# Altium schematic sheet USB.SchDoc
size A4; SheetNumber: 3; SheetTotal: 7
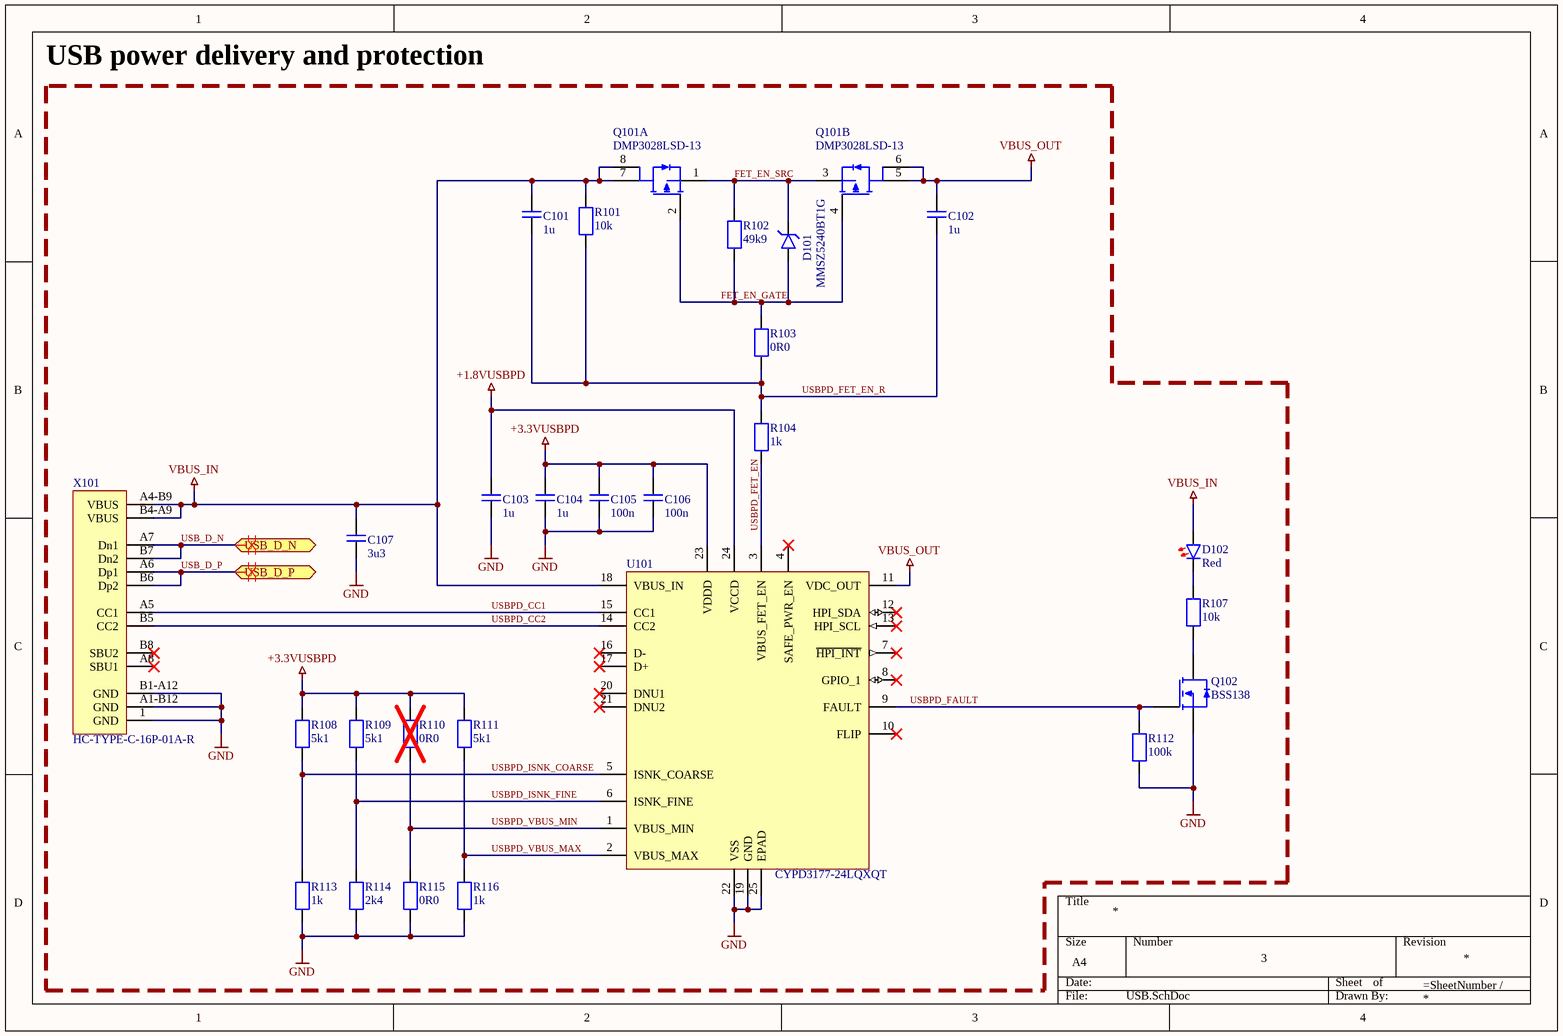
[diagram p0: USB.SchDoc]

## Parts
C101  1u  [CAPC0603]
C102  1u  [CAPC0603]
C103  1u  [CAPC0603]
C104  1u  [CAPC0603]
C105  100n  [CAPC0603]
C106  100n  [CAPC0603]
C107  3u3  [CAPC0603]
D101  MMSZ5240BT1G  [SODFL368160X117]
D102  Red  [LED0603]
Q101  DMP3028LSD-13  [SOIC127P620X175-8]  (parts A,B of 2)
Q102  BSS138  [SOT190P240X290-3]
R101  10k  [RESC0603]
R102  49k9  [RESC0603]
R103  0R0  [RESC0603]
R104  1k  [RESC0603]
R107  10k  [RESC0603]
R108  5k1  [RESC0603]
R109  5k1  [RESC0603]
R110  0R0  [RESC0603]
R111  5k1  [RESC0603]
R112  100k  [RESC0603]
R113  1k  [RESC0603]
R114  2k4  [RESC0603]
R115  0R0  [RESC0603]
R116  1k  [RESC0603]
U101  CYPD3177-24LQXQT  [QFN50P410X410X100-24EP]
X101  HC-TYPE-C-16P-01A-R  [GCT_USB4105-GF-A]

## Blocks framed on the sheet
USB power delivery and protection: C101-C107 D101 D102 Q101 Q102 R101-R104 R107-R116 U101 X101

## Ports
USB_D_N (bidir, see WIRELESS[2B]), USB_D_P (bidir, see WIRELESS[2B])

## Nets
+1.8VUSBPD: C103.2 U101.24(VCCD)
+3.3VUSBPD: C104.2 C105.2 C106.2 R108.2 R109.2 R110.2 R111.2 U101.23(VDDD)
GND: C103.1 C104.1 C105.1 C106.1 C107.1 Q102.2(S) R112.1 R113.1 R114.1 R115.1 R116.1 U101.19(GND) U101.22(VSS) U101.25(EPAD) X101.1(GND) X101.A1-B12(GND) X101.B1-A12(GND)
VBUS_IN: C101.2 C107.2 D102.2 Q101.7(D1) Q101.8(D1) R101.2 U101.18(VBUS_IN) X101.A4-B9(VBUS) X101.B4-A9(VBUS)
VBUS_OUT: C102.2 Q101.5(D2) Q101.6(D2) U101.11(VDC_OUT)
FET_EN_GATE: D101.2 Q101.2(G1) Q101.4(G2) R102.1 R103.2
FET_EN_SRC: D101.1 Q101.1(S1) Q101.3(S2) R102.2
USB_D_N: X101.A7(Dn1) X101.B7(Dn2) ; port USB_D_N
USB_D_P: X101.A6(Dp1) X101.B6(Dp2) ; port USB_D_P
USBPD_CC1: U101.15(CC1) X101.A5(CC1)
USBPD_CC2: U101.14(CC2) X101.B5(CC2)
USBPD_FAULT: Q102.1(G) R112.2 U101.9(FAULT)
USBPD_FET_EN: R104.1 U101.3(VBUS_FET_EN)
USBPD_FET_EN_R: C101.1 C102.1 R101.1 R103.1 R104.2
USBPD_ISNK_COARSE: R108.1 R113.2 U101.5(ISNK_COARSE)
USBPD_ISNK_FINE: R109.1 R114.2 U101.6(ISNK_FINE)
USBPD_VBUS_MAX: R111.1 R116.2 U101.2(VBUS_MAX)
USBPD_VBUS_MIN: R110.1 R115.2 U101.1(VBUS_MIN)
NetD102_1: D102.1 R107.2
NetQ102_3: Q102.3(D) R107.1

Not connected (* = marked no-connect by the designer): U101 4(SAFE_PWR_EN)* 7(~{HPI_INT})* 8(GPIO_1)* 10(FLIP)* 12(HPI_SDA)* 13(HPI_SCL)* 16(D-)* 17(D+)* 20(DNU1)* 21(DNU2)*; X101 A8(SBU1)* B8(SBU2)*

## Layout directives
differential pair: USB_D_N, USB_D_P

## Library data of the parts
C101-C104 = CAPC0603-1u-10: Ceramic capacitor, 1uF,  50V, X5R; MFR: Murata Electronics; MFRN: GRT188R61H105KE13D; SPN: 81-GRT188R61H105KE3D; Checked: Yes; Footprint: 0603; Supplier: Mouser; Link: https://hr.mouser.com/ProductDetail/Murata-Electronics/GRT188R61H105KE13D?qs=drgMNd%252BkGPNIxxtJByMGCg%3D%3D
C105 C106 = CAPC0603-100n-10: Ceramic capacitor, 100nF,  50V, X7R; MFR: KEMET; MFRN: C0603C104K5RACAUTO; SPN: 80-C0603C104K5RAUTO; Checked: Yes; Footprint: 0603; Supplier: Mouser; Link: https://hr.mouser.com/ProductDetail/KEMET/C0603C104K5RACAUTO?qs=8xX%252BF9%252BWV6EZsgKw9G0PqQ%3D%3D
C107 = CAPC0603-3u3-10: Ceramic capacitor, 3.3uF,  25V, X5R; MFR: TDK; MFRN: C1608X5R1E335K080AC; SPN: 810-C1608X5R1E335KAC; Checked: Yes; Footprint: 0603; Supplier: Mouser; Link: https://hr.mouser.com/ProductDetail/TDK/C1608X5R1E335K080AC?qs=6JAMGB%252BEdkxFHV26vmpHrw%3D%3D
D101 = MMSZ5240BT1G: Zener Dioode, 10V, 500mW; MFR: onsemi; SPN: 863-MMSZ5240BT1G; Checked: Yes; Footprint: SOD-123-2; Supplier: Mouser; MFRN: MMSZ5240BT1G; Link: https://hr.mouser.com/ProductDetail/onsemi/MMSZ5240BT1G?qs=P4IOph%252Bbot9clcYADZoEXg%3D%3D
D102 = 150060RS75000: LED Red, 2.3V, 20mA; MFR: Würth Elektronik; SPN: 710-150060RS75000; Checked: Yes; Footprint: 0603; Supplier: Mouser; MFRN: 150060RS75000; Link: https://hr.mouser.com/ProductDetail/Wurth-Elektronik/150060RS75000?qs=LlUlMxKIyB3QnmZ3fw%2FVCA%3D%3D
Q101 = DMP3028LSD-13: MOSFET, 2P-CH, 30V, 6A; MFR: Diodes Incorporated; SPN: 621-DMP3028LSD-13; Checked: Yes; Footprint: SOIC-8; Supplier: Mouser; MFRN: DMP3028LSD-13; Link: https://hr.mouser.com/ProductDetail/Diodes-Incorporated/DMP3028LSD-13?qs=HXx4m3XcTe1Oo5qgV%252BCezQ%3D%3D
Q102 = BSS138: MOSFET, N-CH, 50V, 220mA; MFR: onsemi; SPN: 512-BSS138; Checked: Yes; Footprint: SOT23-3; Supplier: Mouser; MFRN: BSS138; Link: https://hr.mouser.com/ProductDetail/onsemi-Fairchild/BSS138?qs=HK%252BeIG1iaahCeqBvjB4arg%3D%3D
R101 R107 = RES0603-10k-1: Thick film resistor, 10kOhm, 100mW; MFR: YAGEO; MFRN: RC0603FR-1010KL; SPN: 603-RC0603FR-1010KL; Checked: Yes; Footprint: 0603; Supplier: Mouser; Link: https://hr.mouser.com/ProductDetail/YAGEO/RC0603FR-1010KL?qs=sGAEpiMZZMtlubZbdhIBIHvQf5egq9lvqRHakiGwa0o%3D
R102 = RES0603-49k9-1: Thick film resistor, 49.9kOhms, 100mW; MFR: YAGEO; MFRN: RC0603FR-0749K9L; SPN: 603-RC0603FR-0749K9L; Checked: Yes; Footprint: 0603; Supplier: Mouser; Link: https://hr.mouser.com/ProductDetail/YAGEO/RC0603FR-0749K9L?qs=sGAEpiMZZMtlubZbdhIBIItYu4jZFrq85kB0%2FAGdri8%3D
R103 R110 R115 = RES0603-0R0-1: Thick film resistor, 0Ohms, 100mW; MFR: YAGEO; MFRN: RC0603FR-070RL; SPN: 603-RC0603FR-070RL; Checked: Yes; Footprint: 0603; Supplier: Mouser; Link: https://hr.mouser.com/ProductDetail/YAGEO/RC0603FR-070RL?qs=0yPvnVz5%2FmpDQv43TwvCfw%3D%3D
R104 R113 R116 = RES0603-1k-1: Thick film resistor, 1k, 100mW; MFR: YAGEO; MFRN: RC0603FR-071KL; SPN: 603-RC0603FR-071KL; Checked: Yes; Footprint: 0603; Supplier: Mouser; Link: https://hr.mouser.com/ProductDetail/YAGEO/RC0603FR-071KL?qs=VU8sRB4EgwApHsk4rF%2F3zg%3D%3D
R108 R109 R111 = RES0603-5k1-1: Thick film resistor, 5.1kOhms, 100mW; MFR: YAGEO; MFRN: RC0603FR-075K1L; SPN: 603-RC0603FR-075K1L; Checked: Yes; Footprint: 0603; Supplier: Mouser; Link: https://hr.mouser.com/ProductDetail/YAGEO/RC0603FR-075K1L?qs=gt6vzsuosg2jUUwxnI2PJQ%3D%3D
R112 = RES0603-100k-1: Thick film resistor, 100kOhms, 100mW; MFR: YAGEO; MFRN: CRCW0603100KFKEA; SPN: 71-CRCW0603-100K-E3; Checked: Yes; Footprint: 0603; Supplier: Mouser; Link: https://hr.mouser.com/ProductDetail/Vishay-Dale/CRCW0603100KFKEA?qs=6dqgS%252BKntICWHMMdIzt5%2FQ%3D%3D
R114 = RES0603-2k4-1: Thick film resistor, 2.4kOhms, 100mW; MFR: YAGEO; MFRN: RC0603FR-072K4L; SPN: 603-RC0603FR-072K4L; Checked: Yes; Footprint: 0603; Supplier: Mouser; Link: https://hr.mouser.com/ProductDetail/YAGEO/RC0603FR-072K4L?qs=0yPvnVz5%2FmrC6p3yyBfpHw%3D%3D
U101 = CYPD3177-24LQXQT: Generic Description; MFR: Infineon Technologies; SPN: 727-CYPD3177-24LQXQT; Checked: Yes; Footprint: 24-TQFN-EP; Supplier: Mouser; MFRN: CYPD3177-24LQXQT; Link: https://hr.mouser.com/ProductDetail/Infineon-Technologies/CYPD3177-24LQXQT?qs=PzGy0jfpSMvUfBLYWBYBLA%3D%3D
X101 = CONN USB 2.0 TYPE C: USB TYPE-C 3.1, 3A; MFR: GCT; MFRN: USB4105-GF-A; SPN: 640-USB4105-GF-A; Checked: Yes; Footprint: USB Type C; Supplier: Mouser; Link: https://hr.mouser.com/ProductDetail/GCT/USB4105-GF-A?qs=KUoIvG%2F9IlY%2FMLlBMpStpA%3D%3D